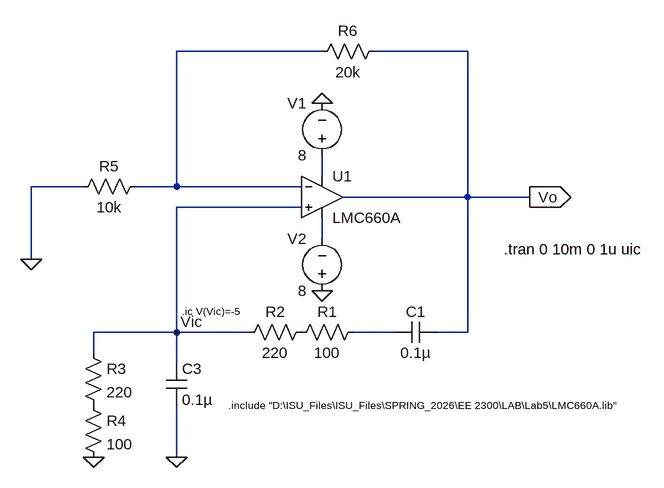
[diagram p0: schematic Exp2.asc]
Exp2.asc, the LTspice schematic file:
Version 4.1
SHEET 1 1032 680
WIRE 208 -80 -16 -80
WIRE 432 -80 288 -80
WIRE 208 112 208 80
WIRE -160 128 -240 128
WIRE -16 128 -16 -80
WIRE -16 128 -80 128
WIRE 176 128 -16 128
WIRE 432 144 432 -80
WIRE 432 144 240 144
WIRE 528 144 432 144
WIRE 176 160 -16 160
WIRE 208 208 208 176
WIRE -240 240 -240 128
WIRE -16 352 -16 160
WIRE -16 352 -144 352
WIRE 96 352 -16 352
WIRE 320 352 256 352
WIRE 432 352 432 144
WIRE 432 352 384 352
WIRE -144 384 -144 352
WIRE -16 400 -16 352
WIRE -16 544 -16 464
FLAG 208 288 0
FLAG 208 0 0
FLAG -144 544 0
FLAG -16 544 0
FLAG -240 240 0
FLAG 528 144 Vo
IOPIN 528 144 Out
FLAG -16 352 Vic
SYMBOL OpAmps\\opamp2 208 80 R0
SYMATTR InstName U1
SYMATTR Value LMC660A
SYMBOL voltage 208 96 R180
WINDOW 0 24 96 Left 2
WINDOW 3 24 16 Left 2
WINDOW 123 0 0 Left 0
WINDOW 39 0 0 Left 0
SYMATTR InstName V1
SYMATTR Value 8
SYMBOL voltage 208 304 R180
WINDOW 0 24 96 Left 2
WINDOW 3 24 16 Left 2
WINDOW 123 0 0 Left 0
WINDOW 39 0 0 Left 0
SYMATTR InstName V2
SYMATTR Value 8
SYMBOL cap 384 336 R90
WINDOW 0 0 32 VBottom 2
WINDOW 3 32 32 VTop 2
SYMATTR InstName C1
SYMATTR Value 0.1µ
SYMBOL res 272 336 R90
WINDOW 0 0 56 VBottom 2
WINDOW 3 32 56 VTop 2
SYMATTR InstName R1
SYMATTR Value 100
SYMBOL res 192 336 R90
WINDOW 0 0 56 VBottom 2
WINDOW 3 32 56 VTop 2
SYMATTR InstName R2
SYMATTR Value 220
SYMBOL res -160 368 R0
SYMATTR InstName R3
SYMATTR Value 220
SYMBOL res -160 448 R0
SYMATTR InstName R4
SYMATTR Value 100
SYMBOL cap -32 400 R0
SYMATTR InstName C3
SYMATTR Value 0.1µ
SYMBOL res -64 112 R90
WINDOW 0 0 56 VBottom 2
WINDOW 3 32 56 VTop 2
SYMATTR InstName R5
SYMATTR Value 10k
SYMBOL res 304 -96 R90
WINDOW 0 0 56 VBottom 2
WINDOW 3 32 56 VTop 2
SYMATTR InstName R6
SYMATTR Value 20k
TEXT -8 320 Left 1 !.ic V(Vic)=-5
TEXT 64 464 Left 1 !.include "D:\\ISU_Files\\ISU_Files\\SPRING_2026\\EE 2300\\LAB\\Lab5\\LMC660A.lib"
TEXT 488 224 Left 2 !.tran 0 10m 0 1u uic

The netlist it stands for:
* Exp2.asc
X§U1 Vic N001 N002 N003 Vo LMC660A  ; pins In+ In- V+ V- OUT
V1 N002 0 8
V2 0 N003 8
C1 Vo N004 0.1µ
R1 N004 P001 100
R2 P001 Vic 220
R3 Vic P002 220
R4 P002 0 100
C3 Vic 0 0.1µ
R5 N001 0 10k
R6 Vo N001 20k
.ic V(Vic)=-5
.include "D:\ISU_Files\ISU_Files\SPRING_2026\EE 2300\LAB\Lab5\LMC660A.lib"
.tran 0 10m 0 1u uic
.backanno
.end